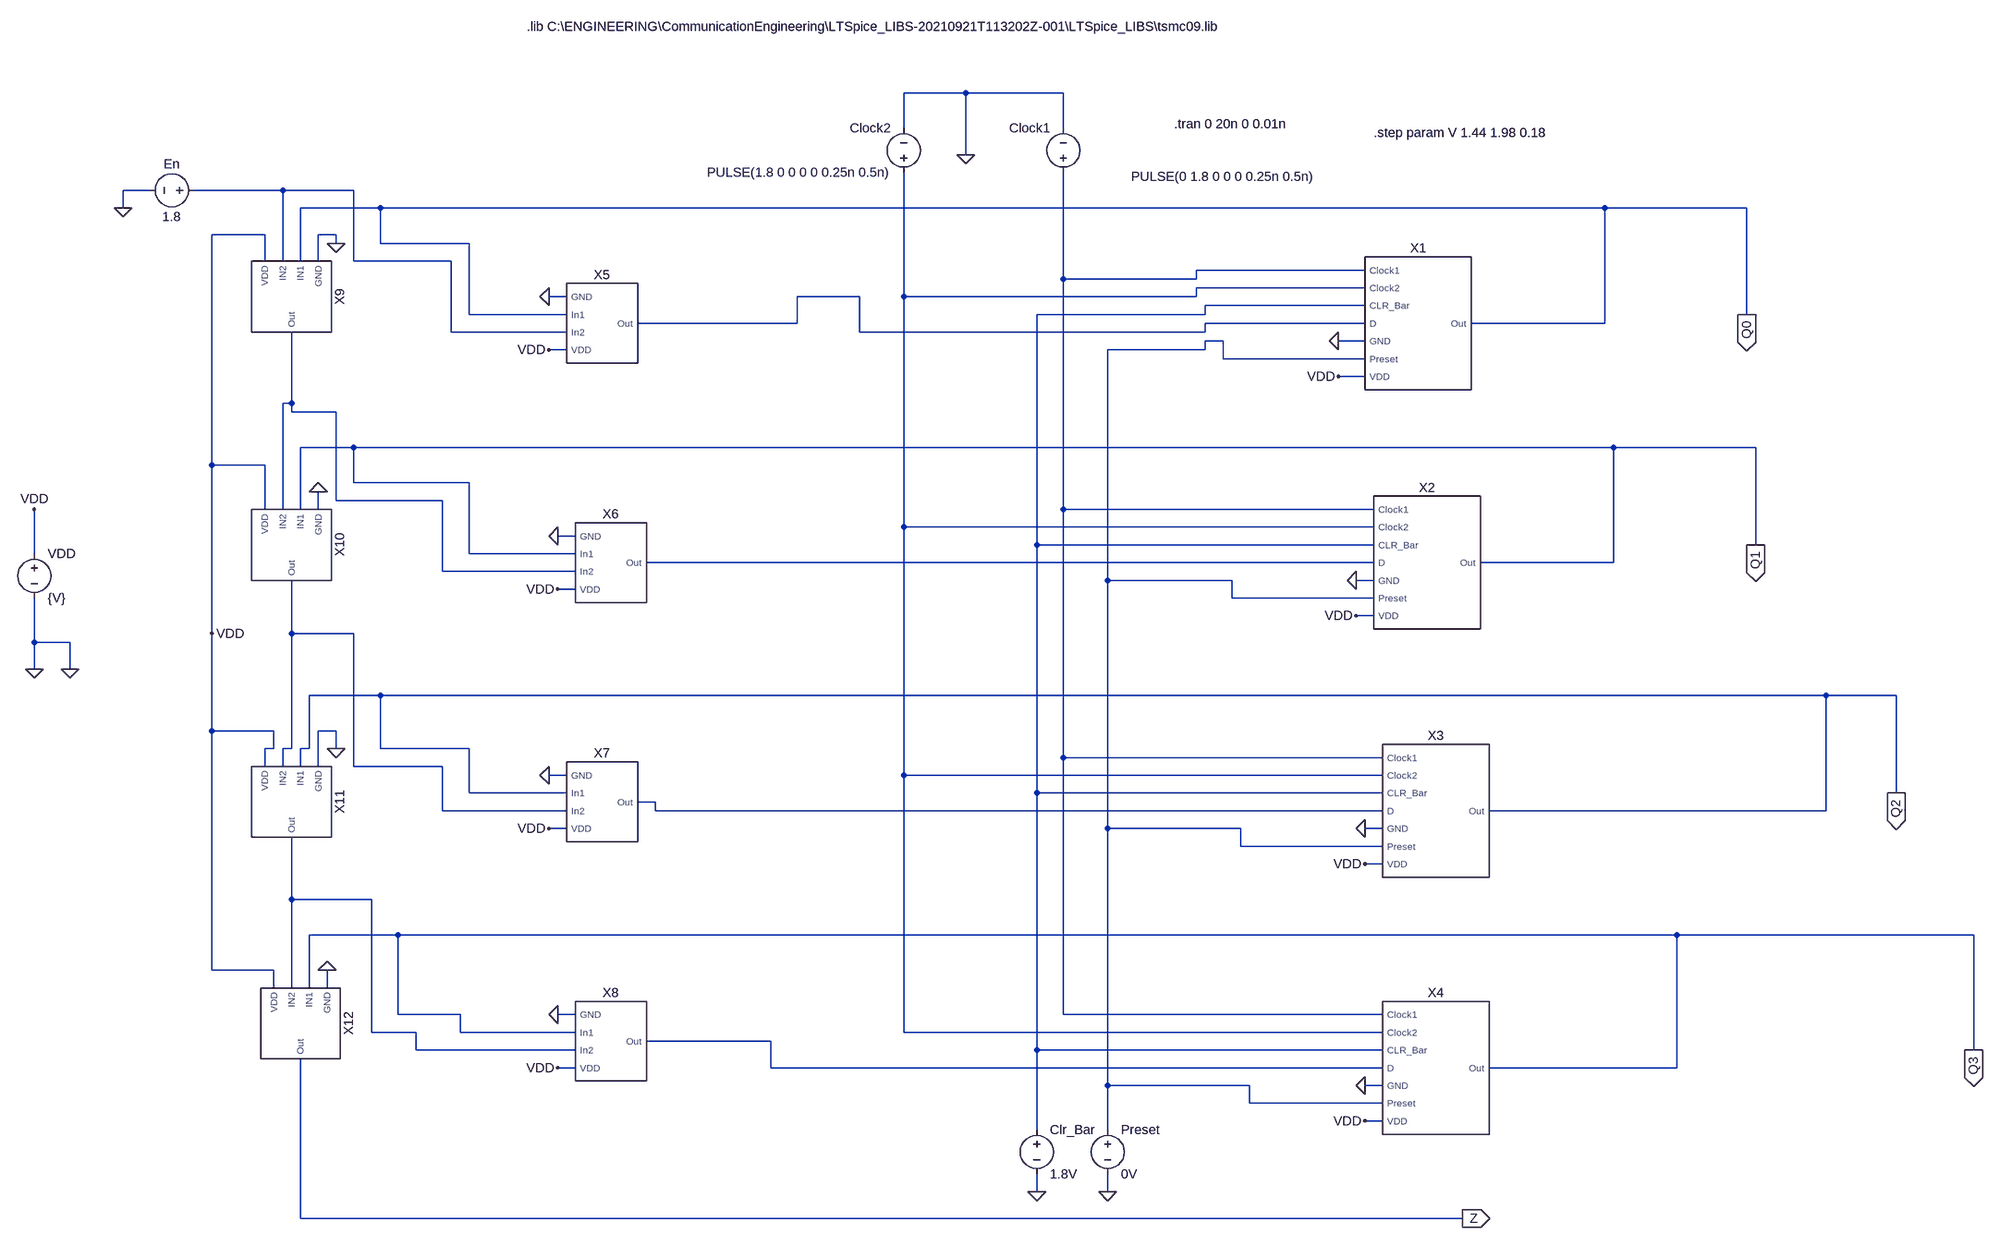
[diagram p0: schematic Counter1_P_Clr2_440_220_final3.asc]
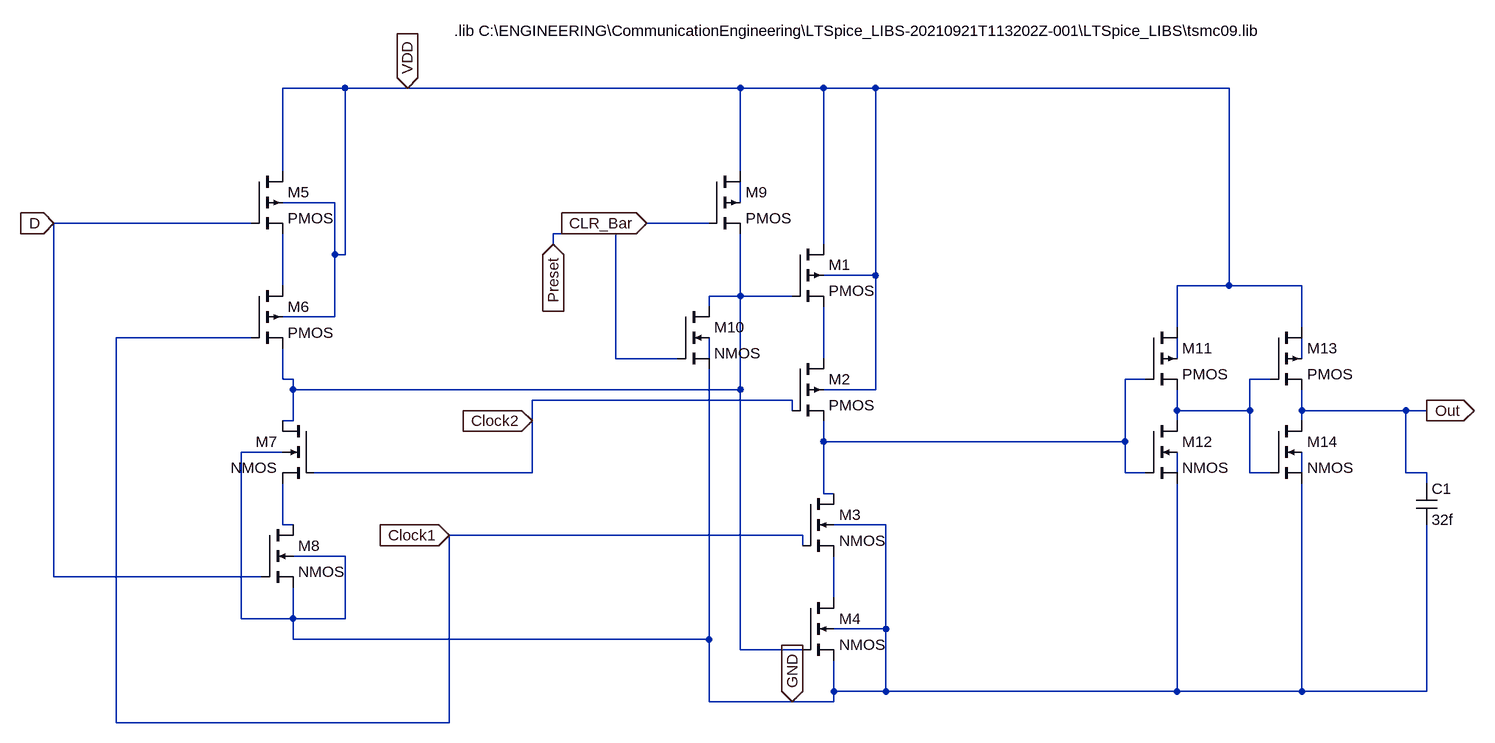
[diagram p1: sub-circuit d_flip_flop_440_220_buffer_pr_clr3exp.asc]
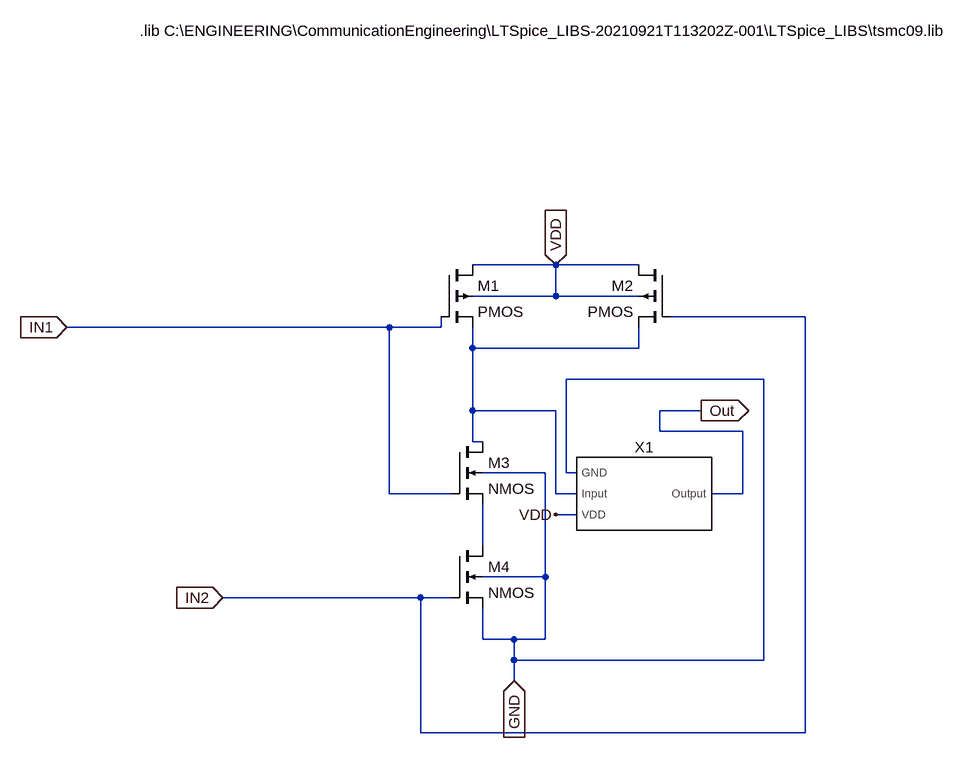
[diagram p2: sub-circuit and_model3exp.asc]
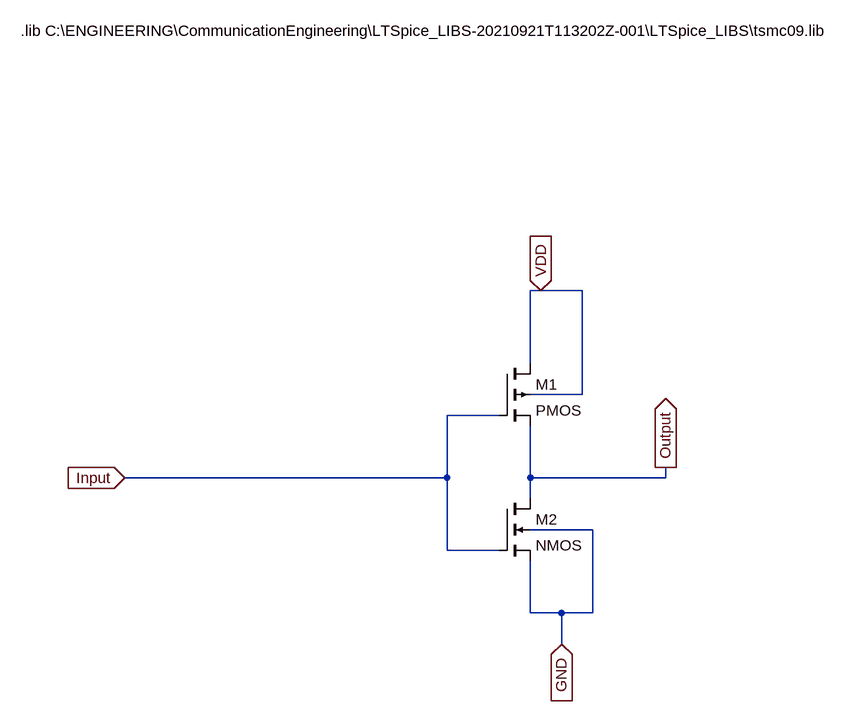
[diagram p3: sub-circuit not_model3exp.asc]
Counter1_P_Clr2_440_220_final3.asc, the LTspice schematic file:
Version 4
SHEET 1 3432 2288
WIRE 912 160 800 160
WIRE 1088 160 912 160
WIRE 800 224 800 160
WIRE 1088 224 1088 160
WIRE 912 272 912 160
WIRE -560 336 -608 336
WIRE -320 336 -480 336
WIRE -192 336 -320 336
WIRE -608 368 -608 336
WIRE -144 368 -288 368
WIRE 2128 368 -144 368
WIRE 2464 368 2128 368
WIRE -352 416 -448 416
WIRE -224 416 -256 416
WIRE -224 432 -224 416
WIRE -144 432 -144 368
WIRE 16 432 -144 432
WIRE -352 464 -352 416
WIRE -320 464 -320 336
WIRE -288 464 -288 368
WIRE -256 464 -256 416
WIRE -192 464 -192 336
WIRE -16 464 -192 464
WIRE 1632 480 1328 480
WIRE 1088 496 1088 304
WIRE 1328 496 1328 480
WIRE 1328 496 1088 496
WIRE 1632 512 1328 512
WIRE 192 528 160 528
WIRE 720 528 608 528
WIRE 800 528 800 304
WIRE 1328 528 1328 512
WIRE 1328 528 800 528
WIRE 1632 544 1344 544
WIRE 16 560 16 432
WIRE 192 560 16 560
WIRE 1344 560 1344 544
WIRE 1344 560 1040 560
WIRE 2464 560 2464 368
WIRE 608 576 608 528
WIRE 608 576 320 576
WIRE 1632 576 1344 576
WIRE 2128 576 2128 368
WIRE 2128 576 1824 576
WIRE -16 592 -16 464
WIRE 192 592 -16 592
WIRE 720 592 720 528
WIRE 1344 592 1344 576
WIRE 1344 592 720 592
WIRE 1376 608 1344 608
WIRE 1632 608 1584 608
WIRE 192 624 160 624
WIRE 1344 624 1344 608
WIRE 1344 624 1168 624
WIRE 1376 640 1376 608
WIRE 1632 640 1376 640
WIRE 1632 672 1584 672
WIRE -304 720 -304 592
WIRE -304 720 -320 720
WIRE -304 736 -304 720
WIRE -224 736 -304 736
WIRE -192 800 -288 800
WIRE 2144 800 -192 800
WIRE 2480 800 2144 800
WIRE -448 832 -448 416
WIRE -352 832 -448 832
WIRE -192 864 -192 800
WIRE 16 864 -192 864
WIRE -224 896 -224 736
WIRE -32 896 -224 896
WIRE -352 912 -352 832
WIRE -320 912 -320 720
WIRE -288 912 -288 800
WIRE -256 912 -256 880
WIRE 1088 912 1088 496
WIRE 1648 912 1088 912
WIRE 800 944 800 528
WIRE 1648 944 800 944
WIRE 208 960 176 960
WIRE 1040 976 1040 560
WIRE 1648 976 1040 976
WIRE 2480 976 2480 800
WIRE -768 992 -768 912
WIRE 16 992 16 864
WIRE 208 992 16 992
WIRE 1648 1008 336 1008
WIRE 2144 1008 2144 800
WIRE 2144 1008 1840 1008
WIRE -32 1024 -32 896
WIRE 208 1024 -32 1024
WIRE 1168 1040 1168 624
WIRE 1392 1040 1168 1040
WIRE 1648 1040 1616 1040
WIRE 208 1056 176 1056
WIRE 1392 1072 1392 1040
WIRE 1648 1072 1392 1072
WIRE 1648 1104 1616 1104
WIRE -448 1136 -448 832
WIRE -304 1136 -304 1040
WIRE -192 1136 -304 1136
WIRE -768 1152 -768 1072
WIRE -704 1152 -768 1152
WIRE -768 1200 -768 1152
WIRE -704 1200 -704 1152
WIRE -144 1248 -272 1248
WIRE 2720 1248 -144 1248
WIRE 2992 1248 2720 1248
WIRE -448 1312 -448 1136
WIRE -336 1312 -448 1312
WIRE -224 1312 -256 1312
WIRE -336 1344 -336 1312
WIRE -336 1344 -352 1344
WIRE -304 1344 -304 1136
WIRE -304 1344 -320 1344
WIRE -272 1344 -272 1248
WIRE -272 1344 -288 1344
WIRE -224 1344 -224 1312
WIRE -144 1344 -144 1248
WIRE 16 1344 -144 1344
WIRE 1088 1360 1088 912
WIRE 1664 1360 1088 1360
WIRE -352 1376 -352 1344
WIRE -320 1376 -320 1344
WIRE -288 1376 -288 1344
WIRE -256 1376 -256 1312
WIRE -192 1376 -192 1136
WIRE -32 1376 -192 1376
WIRE 192 1392 160 1392
WIRE 800 1392 800 944
WIRE 1664 1392 800 1392
WIRE 16 1424 16 1344
WIRE 192 1424 16 1424
WIRE 1040 1424 1040 976
WIRE 1664 1424 1040 1424
WIRE 2992 1424 2992 1248
WIRE 352 1440 320 1440
WIRE -32 1456 -32 1376
WIRE 192 1456 -32 1456
WIRE 352 1456 352 1440
WIRE 1664 1456 352 1456
WIRE 2720 1456 2720 1248
WIRE 2720 1456 1856 1456
WIRE 192 1488 160 1488
WIRE 1168 1488 1168 1040
WIRE 1408 1488 1168 1488
WIRE 1664 1488 1632 1488
WIRE 1408 1520 1408 1488
WIRE 1664 1520 1408 1520
WIRE 1664 1552 1632 1552
WIRE -304 1616 -304 1504
WIRE -160 1616 -304 1616
WIRE -112 1680 -272 1680
WIRE 2336 1680 -112 1680
WIRE 3360 1680 2336 1680
WIRE -448 1744 -448 1312
WIRE -336 1744 -448 1744
WIRE -336 1776 -336 1744
WIRE -304 1776 -304 1616
WIRE -272 1776 -272 1680
WIRE -240 1776 -240 1744
WIRE -112 1824 -112 1680
WIRE 0 1824 -112 1824
WIRE 208 1824 176 1824
WIRE 1088 1824 1088 1360
WIRE 1664 1824 1088 1824
WIRE -160 1856 -160 1616
WIRE -80 1856 -160 1856
WIRE 0 1856 0 1824
WIRE 208 1856 0 1856
WIRE 800 1856 800 1392
WIRE 1664 1856 800 1856
WIRE 560 1872 336 1872
WIRE -80 1888 -80 1856
WIRE 208 1888 -80 1888
WIRE 1040 1888 1040 1424
WIRE 1664 1888 1040 1888
WIRE 3360 1888 3360 1680
WIRE 208 1920 176 1920
WIRE 560 1920 560 1872
WIRE 1664 1920 560 1920
WIRE 2336 1920 2336 1680
WIRE 2336 1920 1856 1920
WIRE 1168 1952 1168 1488
WIRE 1424 1952 1168 1952
WIRE 1664 1952 1632 1952
WIRE 1424 1984 1424 1952
WIRE 1664 1984 1424 1984
WIRE 1664 2016 1632 2016
WIRE 1040 2032 1040 1888
WIRE 1168 2032 1168 1952
WIRE 1040 2144 1040 2112
WIRE 1168 2144 1168 2112
WIRE -288 2192 -288 1904
WIRE 1808 2192 -288 2192
FLAG -608 368 0
FLAG 1040 2144 0
FLAG 1168 2144 0
FLAG 912 272 0
FLAG 1808 2192 Z
IOPIN 1808 2192 Out
FLAG 2464 560 Q0
IOPIN 2464 560 Out
FLAG 2480 976 Q1
IOPIN 2480 976 Out
FLAG 2992 1424 Q2
IOPIN 2992 1424 Out
FLAG 3360 1888 Q3
IOPIN 3360 1888 Out
FLAG -768 912 VDD
FLAG -448 1136 VDD
FLAG -768 1200 0
FLAG -704 1200 0
FLAG -224 432 0
FLAG -256 880 0
FLAG -224 1344 0
FLAG -240 1744 0
FLAG 160 1392 0
FLAG 176 960 0
FLAG 160 528 0
FLAG 176 1824 0
FLAG 1632 1488 0
FLAG 1616 1040 0
FLAG 1584 608 0
FLAG 1632 1952 0
FLAG 176 1920 VDD
FLAG 160 1488 VDD
FLAG 176 1056 VDD
FLAG 160 624 VDD
FLAG 1584 672 VDD
FLAG 1616 1104 VDD
FLAG 1632 1552 VDD
FLAG 1632 2016 VDD
SYMBOL voltage -464 336 R90
WINDOW 0 -32 56 VBottom 2
WINDOW 3 32 56 VTop 2
WINDOW 123 0 0 Left 0
WINDOW 39 0 0 Left 0
SYMATTR InstName En
SYMATTR Value 1.8
SYMBOL voltage 1088 320 R180
WINDOW 0 24 96 Left 2
WINDOW 3 -453 9 Left 2
WINDOW 123 0 0 Left 0
WINDOW 39 0 0 Left 0
SYMATTR InstName Clock1
SYMATTR Value PULSE(0 1.8 0 0 0 0.25n 0.5n)
SYMBOL voltage 800 320 R180
WINDOW 0 24 96 Left 2
WINDOW 3 24 16 Left 2
WINDOW 123 0 0 Left 0
WINDOW 39 0 0 Left 0
SYMATTR InstName Clock2
SYMATTR Value PULSE(1.8 0 0 0 0 0.25n 0.5n)
SYMBOL voltage 1168 2016 R0
WINDOW 123 0 0 Left 0
WINDOW 39 0 0 Left 0
SYMATTR InstName Preset
SYMATTR Value 0V
SYMBOL voltage 1040 2016 R0
WINDOW 123 0 0 Left 0
WINDOW 39 0 0 Left 0
SYMATTR InstName Clr_Bar
SYMATTR Value 1.8V
SYMBOL voltage -768 976 R0
WINDOW 123 0 0 Left 0
WINDOW 39 0 0 Left 0
SYMATTR InstName VDD
SYMATTR Value {V}
SYMBOL d_flip_flop_440_220_buffer_pr_clr3EXP 1728 576 R0
SYMATTR InstName X1
SYMBOL d_flip_flop_440_220_buffer_pr_clr3EXP 1744 1008 R0
SYMATTR InstName X2
SYMBOL d_flip_flop_440_220_buffer_pr_clr3EXP 1760 1456 R0
SYMATTR InstName X3
SYMBOL d_flip_flop_440_220_buffer_pr_clr3EXP 1760 1920 R0
SYMATTR InstName X4
SYMBOL xor_model3EXP 256 576 R0
SYMATTR InstName X5
SYMBOL xor_model3EXP 272 1008 R0
SYMATTR InstName X6
SYMBOL xor_model3EXP 256 1440 R0
SYMATTR InstName X7
SYMBOL xor_model3EXP 272 1872 R0
SYMATTR InstName X8
SYMBOL and_model3EXP -304 528 R90
SYMATTR InstName X9
SYMBOL and_model3EXP -304 976 R90
SYMATTR InstName X10
SYMBOL and_model3EXP -304 1440 R90
SYMATTR InstName X11
SYMBOL and_model3EXP -288 1840 R90
SYMATTR InstName X12
TEXT 120 40 Left 2 !.lib C:\\ENGINEERING\\CommunicationEngineering\\LTSpice_LIBS-20210921T113202Z-001\\LTSpice_LIBS\\tsmc09.lib
TEXT 1288 216 Left 2 !.tran 0 20n 0 0.01n
TEXT 1648 232 Left 2 !.step param V 1.44 1.98 0.18

d_flip_flop_440_220_buffer_pr_clr3exp.asc, the sub-circuit schematic file:
Version 4
SHEET 1 1644 1068
WIRE -240 64 -336 64
WIRE -144 64 -240 64
WIRE 368 64 -144 64
WIRE 496 64 368 64
WIRE 576 64 496 64
WIRE 1120 64 576 64
WIRE -336 192 -336 64
WIRE 368 192 368 64
WIRE -256 240 -336 240
WIRE 368 240 368 208
WIRE -384 272 -688 272
WIRE 320 272 224 272
WIRE 176 288 80 288
WIRE 80 304 80 288
WIRE 496 304 496 64
WIRE -256 320 -256 240
WIRE -240 320 -240 64
WIRE -240 320 -256 320
WIRE 576 352 576 64
WIRE 576 352 496 352
WIRE -336 368 -336 288
WIRE 1120 368 1120 64
WIRE 1120 368 1040 368
WIRE 1232 368 1120 368
WIRE 368 384 368 288
WIRE 368 384 320 384
WIRE 448 384 368 384
WIRE 320 400 320 384
WIRE -256 416 -256 320
WIRE -256 416 -336 416
WIRE 1040 432 1040 368
WIRE 1232 432 1232 368
WIRE -384 448 -592 448
WIRE 176 480 176 288
WIRE 272 480 176 480
WIRE 320 480 320 448
WIRE 496 480 496 400
WIRE 1040 480 1040 448
WIRE 1232 480 1232 448
WIRE -336 512 -336 464
WIRE -320 512 -336 512
WIRE 992 512 960 512
WIRE 1184 512 1152 512
WIRE -320 528 -320 512
WIRE 368 528 368 384
WIRE 368 528 -320 528
WIRE 576 528 576 352
WIRE 576 528 496 528
WIRE 448 544 48 544
WIRE 448 560 448 544
WIRE 1040 560 1040 528
WIRE 1152 560 1152 512
WIRE 1152 560 1040 560
WIRE 1232 560 1232 528
WIRE 1392 560 1232 560
WIRE 1424 560 1392 560
WIRE -320 576 -320 528
WIRE -320 576 -336 576
WIRE 48 576 48 544
WIRE 1040 576 1040 560
WIRE 1232 576 1232 560
WIRE 496 608 496 576
WIRE 960 608 960 512
WIRE 960 608 496 608
WIRE -336 624 -400 624
WIRE 48 656 48 576
WIRE 48 656 -288 656
WIRE 960 656 960 608
WIRE 992 656 960 656
WIRE 1040 656 1040 624
WIRE 1152 656 1152 560
WIRE 1184 656 1152 656
WIRE 1232 656 1232 624
WIRE 1392 656 1392 560
WIRE 1424 656 1392 656
WIRE 1424 672 1424 656
WIRE 496 688 496 608
WIRE 512 688 496 688
WIRE -336 736 -336 672
WIRE -320 736 -336 736
WIRE 592 736 512 736
WIRE 464 752 -80 752
WIRE 464 768 464 752
WIRE -240 784 -320 784
WIRE -688 816 -688 272
WIRE -368 816 -688 816
WIRE 512 848 512 784
WIRE -400 880 -400 624
WIRE -320 880 -320 832
WIRE -320 880 -400 880
WIRE -240 880 -240 784
WIRE -240 880 -320 880
WIRE 592 896 592 736
WIRE 592 896 512 896
WIRE -320 912 -320 880
WIRE 320 912 320 496
WIRE 320 912 -320 912
WIRE 368 928 368 528
WIRE 464 928 368 928
WIRE 512 992 512 944
WIRE 592 992 592 896
WIRE 592 992 512 992
WIRE 1040 992 1040 672
WIRE 1040 992 592 992
WIRE 1232 992 1232 672
WIRE 1232 992 1040 992
WIRE 1424 992 1424 736
WIRE 1424 992 1232 992
WIRE 320 1008 320 912
WIRE 448 1008 320 1008
WIRE 512 1008 512 992
WIRE 512 1008 448 1008
WIRE -592 1040 -592 448
WIRE -80 1040 -80 752
WIRE -80 1040 -592 1040
FLAG -688 272 D
IOPIN -688 272 In
FLAG -80 752 Clock1
IOPIN -80 752 In
FLAG 48 576 Clock2
IOPIN 48 576 In
FLAG 1424 560 Out
IOPIN 1424 560 Out
FLAG 80 304 Preset
IOPIN 80 304 In
FLAG 224 272 CLR_Bar
IOPIN 224 272 In
FLAG -144 64 VDD
IOPIN -144 64 In
FLAG 448 1008 GND
IOPIN 448 1008 In
SYMBOL pmos4 448 304 R0
SYMATTR InstName M1
SYMATTR Value2 l=90n w=440n
SYMBOL pmos4 448 480 R0
SYMATTR InstName M2
SYMATTR Value2 l=90n w=440n
SYMBOL nmos4 464 688 R0
SYMATTR InstName M3
SYMATTR Value2 l=90n w=220n
SYMBOL nmos4 464 848 R0
SYMATTR InstName M4
SYMATTR Value2 l=90n w=220n
SYMBOL cap 1408 672 R0
SYMATTR InstName C1
SYMATTR Value 32f
SYMBOL pmos4 -384 192 R0
SYMATTR InstName M5
SYMATTR Value2 l=90n w=440n
SYMBOL pmos4 -384 368 R0
SYMATTR InstName M6
SYMATTR Value2 l=90n w=440n
SYMBOL nmos4 -288 576 M0
SYMATTR InstName M7
SYMATTR Value2 l=90n w=220n
SYMBOL nmos4 -368 736 R0
SYMATTR InstName M8
SYMATTR Value2 l=90n w=220n
SYMBOL pmos4 320 192 R0
SYMATTR InstName M9
SYMATTR Value2 l=90n w=440n
SYMBOL nmos4 272 400 R0
SYMATTR InstName M10
SYMATTR Value2 l=90n w=220n
SYMBOL pmos4 992 432 R0
SYMATTR InstName M11
SYMATTR Value2 l=90n w=440n
SYMBOL nmos4 992 576 R0
SYMATTR InstName M12
SYMATTR Value2 l=90n w=220n
SYMBOL pmos4 1184 432 R0
SYMATTR InstName M13
SYMATTR Value2 l=90n w=440n
SYMBOL nmos4 1184 576 R0
SYMATTR InstName M14
SYMATTR Value2 l=90n w=220n
TEXT -72 -24 Left 2 !.lib C:\\ENGINEERING\\CommunicationEngineering\\LTSpice_LIBS-20210921T113202Z-001\\LTSpice_LIBS\\tsmc09.lib

and_model3exp.asc, the sub-circuit schematic file:
Version 4
SHEET 1 1644 1040
WIRE 912 288 784 288
WIRE 1040 288 912 288
WIRE 912 336 912 288
WIRE 912 336 784 336
WIRE 1040 336 912 336
WIRE 1296 368 1088 368
WIRE 656 384 160 384
WIRE 736 384 736 368
WIRE 736 384 656 384
WIRE 784 416 784 384
WIRE 1040 416 1040 384
WIRE 1040 416 784 416
WIRE 1232 464 928 464
WIRE 784 512 784 416
WIRE 912 512 784 512
WIRE 1136 512 1072 512
WIRE 1072 544 1072 512
WIRE 1200 544 1072 544
WIRE 784 560 784 512
WIRE 800 560 784 560
WIRE 896 608 800 608
WIRE 928 608 928 464
WIRE 944 608 928 608
WIRE 656 640 656 384
WIRE 752 640 656 640
WIRE 912 640 912 512
WIRE 944 640 912 640
WIRE 1200 640 1200 544
WIRE 1200 640 1152 640
WIRE 944 672 912 672
WIRE 800 720 800 656
WIRE 896 768 896 608
WIRE 896 768 800 768
WIRE 704 800 400 800
WIRE 752 800 704 800
WIRE 800 864 800 816
WIRE 848 864 800 864
WIRE 896 864 896 768
WIRE 896 864 848 864
WIRE 848 896 848 864
WIRE 1232 896 1232 464
WIRE 1232 896 848 896
WIRE 848 928 848 896
WIRE 704 1008 704 800
WIRE 1296 1008 1296 368
WIRE 1296 1008 704 1008
FLAG 1136 512 Out
IOPIN 1136 512 Out
FLAG 160 384 IN1
IOPIN 160 384 In
FLAG 400 800 IN2
IOPIN 400 800 In
FLAG 912 288 VDD
IOPIN 912 288 In
FLAG 848 928 GND
IOPIN 848 928 In
FLAG 912 672 VDD
SYMBOL pmos4 736 288 R0
SYMATTR InstName M1
SYMATTR Value2 l=90n w=440n
SYMBOL pmos4 1088 288 M0
SYMATTR InstName M2
SYMATTR Value2 l=90n w=440n
SYMBOL nmos4 752 560 R0
SYMATTR InstName M3
SYMATTR Value2 l=90n w=220n
SYMBOL nmos4 752 720 R0
SYMATTR InstName M4
SYMATTR Value2 l=90n w=220n
SYMBOL not_model3EXP 1040 640 R0
SYMATTR InstName X1
TEXT 272 -72 Left 2 !.lib C:\\ENGINEERING\\CommunicationEngineering\\LTSpice_LIBS-20210921T113202Z-001\\LTSpice_LIBS\\tsmc09.lib

not_model3exp.asc, the sub-circuit schematic file:
Version 4
SHEET 1 888 680
WIRE 240 -96 224 -96
WIRE 304 -96 240 -96
WIRE 224 16 224 -96
WIRE 304 64 304 -96
WIRE 304 64 224 64
WIRE 176 96 96 96
WIRE 96 192 96 96
WIRE 96 192 -400 192
WIRE 224 192 224 112
WIRE 432 192 432 176
WIRE 432 192 224 192
WIRE 224 224 224 192
WIRE 320 272 224 272
WIRE 96 304 96 192
WIRE 176 304 96 304
WIRE 224 400 224 320
WIRE 272 400 224 400
WIRE 320 400 320 272
WIRE 320 400 272 400
WIRE 272 448 272 400
FLAG -400 192 Input
IOPIN -400 192 In
FLAG 432 176 Output
IOPIN 432 176 Out
FLAG 240 -96 VDD
IOPIN 240 -96 In
FLAG 272 448 GND
IOPIN 272 448 In
SYMBOL pmos4 176 16 R0
SYMATTR InstName M1
SYMATTR Value2 l=90n w=440n
SYMBOL nmos4 176 224 R0
SYMATTR InstName M2
SYMATTR Value2 l=90n w=220n
TEXT -560 -496 Left 2 !.lib C:\\ENGINEERING\\CommunicationEngineering\\LTSpice_LIBS-20210921T113202Z-001\\LTSpice_LIBS\\tsmc09.lib

The netlist it stands for:
* Counter1_P_Clr2_440_220_final3.asc
V§En N001 0 1.8
V§Clock1 N002 0 PULSE(0 1.8 0 0 0 0.25n 0.5n)
V§Clock2 N003 0 PULSE(1.8 0 0 0 0 0.25n 0.5n)
V§Preset N006 0 0V
V§Clr_Bar N005 0 1.8V
VDD VDD 0 {V}
XX1 N002 N003 N005 N004 0 N006 VDD Q0 d_flip_flop_440_220_buffer_pr_clr3exp
XX2 N002 N003 N005 N008 0 N006 VDD Q1 d_flip_flop_440_220_buffer_pr_clr3exp
XX3 N002 N003 N005 N010 0 N006 VDD Q2 d_flip_flop_440_220_buffer_pr_clr3exp
XX4 N002 N003 N005 N012 0 N006 VDD Q3 d_flip_flop_440_220_buffer_pr_clr3exp
XX5 0 Q0 N001 VDD N004 xor_model3EXP  ; pins GND In1 In2 VDD Out
XX6 0 Q1 N007 VDD N008 xor_model3EXP  ; pins GND In1 In2 VDD Out
XX7 0 Q2 N009 VDD N010 xor_model3EXP  ; pins GND In1 In2 VDD Out
XX8 0 Q3 N011 VDD N012 xor_model3EXP  ; pins GND In1 In2 VDD Out
XX9 0 Q0 N001 VDD N007 and_model3exp
XX10 0 Q1 N007 VDD N009 and_model3exp
XX11 0 Q2 N009 VDD N011 and_model3exp
XX12 0 Q3 N011 VDD Z and_model3exp

* block symbol definitions
.subckt d_flip_flop_440_220_buffer_pr_clr3exp Clock1 Clock2 CLR_Bar D GND Preset VDD Out
M1 VDD N003 N005 VDD PMOS l=90n w=440n
M2 N005 Clock2 N008 VDD PMOS l=90n w=440n
M3 N008 Clock1 N013 GND NMOS l=90n w=220n
M4 N013 N003 GND GND NMOS l=90n w=220n
C1 Out GND 32f
M5 VDD D N002 VDD PMOS l=90n w=440n
M6 N002 Clock1 N003 VDD PMOS l=90n w=440n
M7 N003 Clock2 N012 GND NMOS l=90n w=220n
M8 N012 D GND GND NMOS l=90n w=220n
M9 VDD CLR_Bar N003 N001 PMOS l=90n w=440n
M10 N003 Preset GND N004 NMOS l=90n w=220n
M11 VDD N008 N009 N006 PMOS l=90n w=440n
M12 N009 N008 GND N010 NMOS l=90n w=220n
M13 VDD N009 Out N007 PMOS l=90n w=440n
M14 Out N009 GND N011 NMOS l=90n w=220n
.lib C:\ENGINEERING\CommunicationEngineering\LTSpice_LIBS-20210921T113202Z-001\LTSpice_LIBS\tsmc09.lib
.ends d_flip_flop_440_220_buffer_pr_clr3exp

.subckt and_model3exp GND IN1 IN2 VDD Out
M1 VDD IN1 N001 VDD PMOS l=90n w=440n
M2 VDD IN2 N001 VDD PMOS l=90n w=440n
M3 N001 IN1 N002 GND NMOS l=90n w=220n
M4 N002 IN2 GND GND NMOS l=90n w=220n
XX1 GND N001 VDD Out not_model3exp
.lib C:\ENGINEERING\CommunicationEngineering\LTSpice_LIBS-20210921T113202Z-001\LTSpice_LIBS\tsmc09.lib
.ends and_model3exp

.subckt not_model3exp GND Input VDD Output
M1 VDD Input Output VDD PMOS l=90n w=440n
M2 Output Input GND GND NMOS l=90n w=220n
.lib C:\ENGINEERING\CommunicationEngineering\LTSpice_LIBS-20210921T113202Z-001\LTSpice_LIBS\tsmc09.lib
.ends not_model3exp

.model NMOS NMOS
.model PMOS PMOS
.lib standard.mos
.lib C:\ENGINEERING\CommunicationEngineering\LTSpice_LIBS-20210921T113202Z-001\LTSpice_LIBS\tsmc09.lib
.tran 0 20n 0 0.01n
.step param V 1.44 1.98 0.18
.backanno
.end